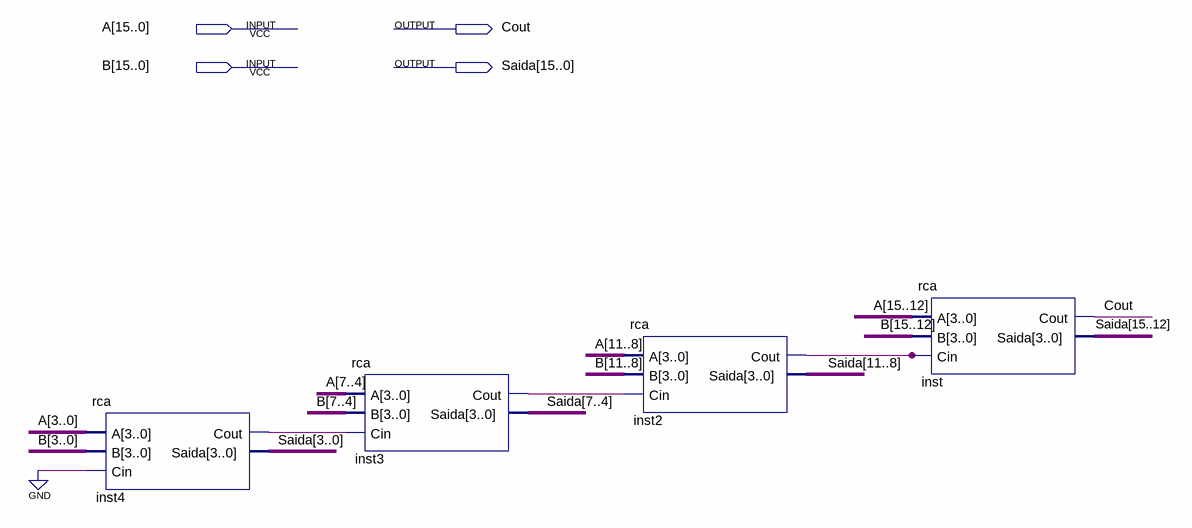
[diagram p0: schematic sheet]
// Quartus schematic rca16.bdf as structural Verilog: 4 symbols, 4 pins
module rca16 (
  input  [15:0] A,
  input  [15:0] B,
  output Cout,
  output [15:0] Saida
);

  wire inst2_cout, inst3_cout, inst4_cout;

  rca inst4 (.A(A[3:0]), .B(B[3:0]), .Cin(1'b0), .Cout(inst4_cout), .Saida(Saida[3:0]));
  rca inst3 (.A(A[7:4]), .B(B[7:4]), .Cin(inst4_cout), .Cout(inst3_cout), .Saida(Saida[7:4]));
  rca inst2 (.A(A[11:8]), .B(B[11:8]), .Cin(inst3_cout), .Cout(inst2_cout), .Saida(Saida[11:8]));
  rca inst (.A(A[15:12]), .B(B[15:12]), .Cin(inst2_cout), .Cout(Cout), .Saida(Saida[15:12]));
endmodule
